# EAGLE schematic arduino_smartsensor_shield (EAGLE 7.4.0)
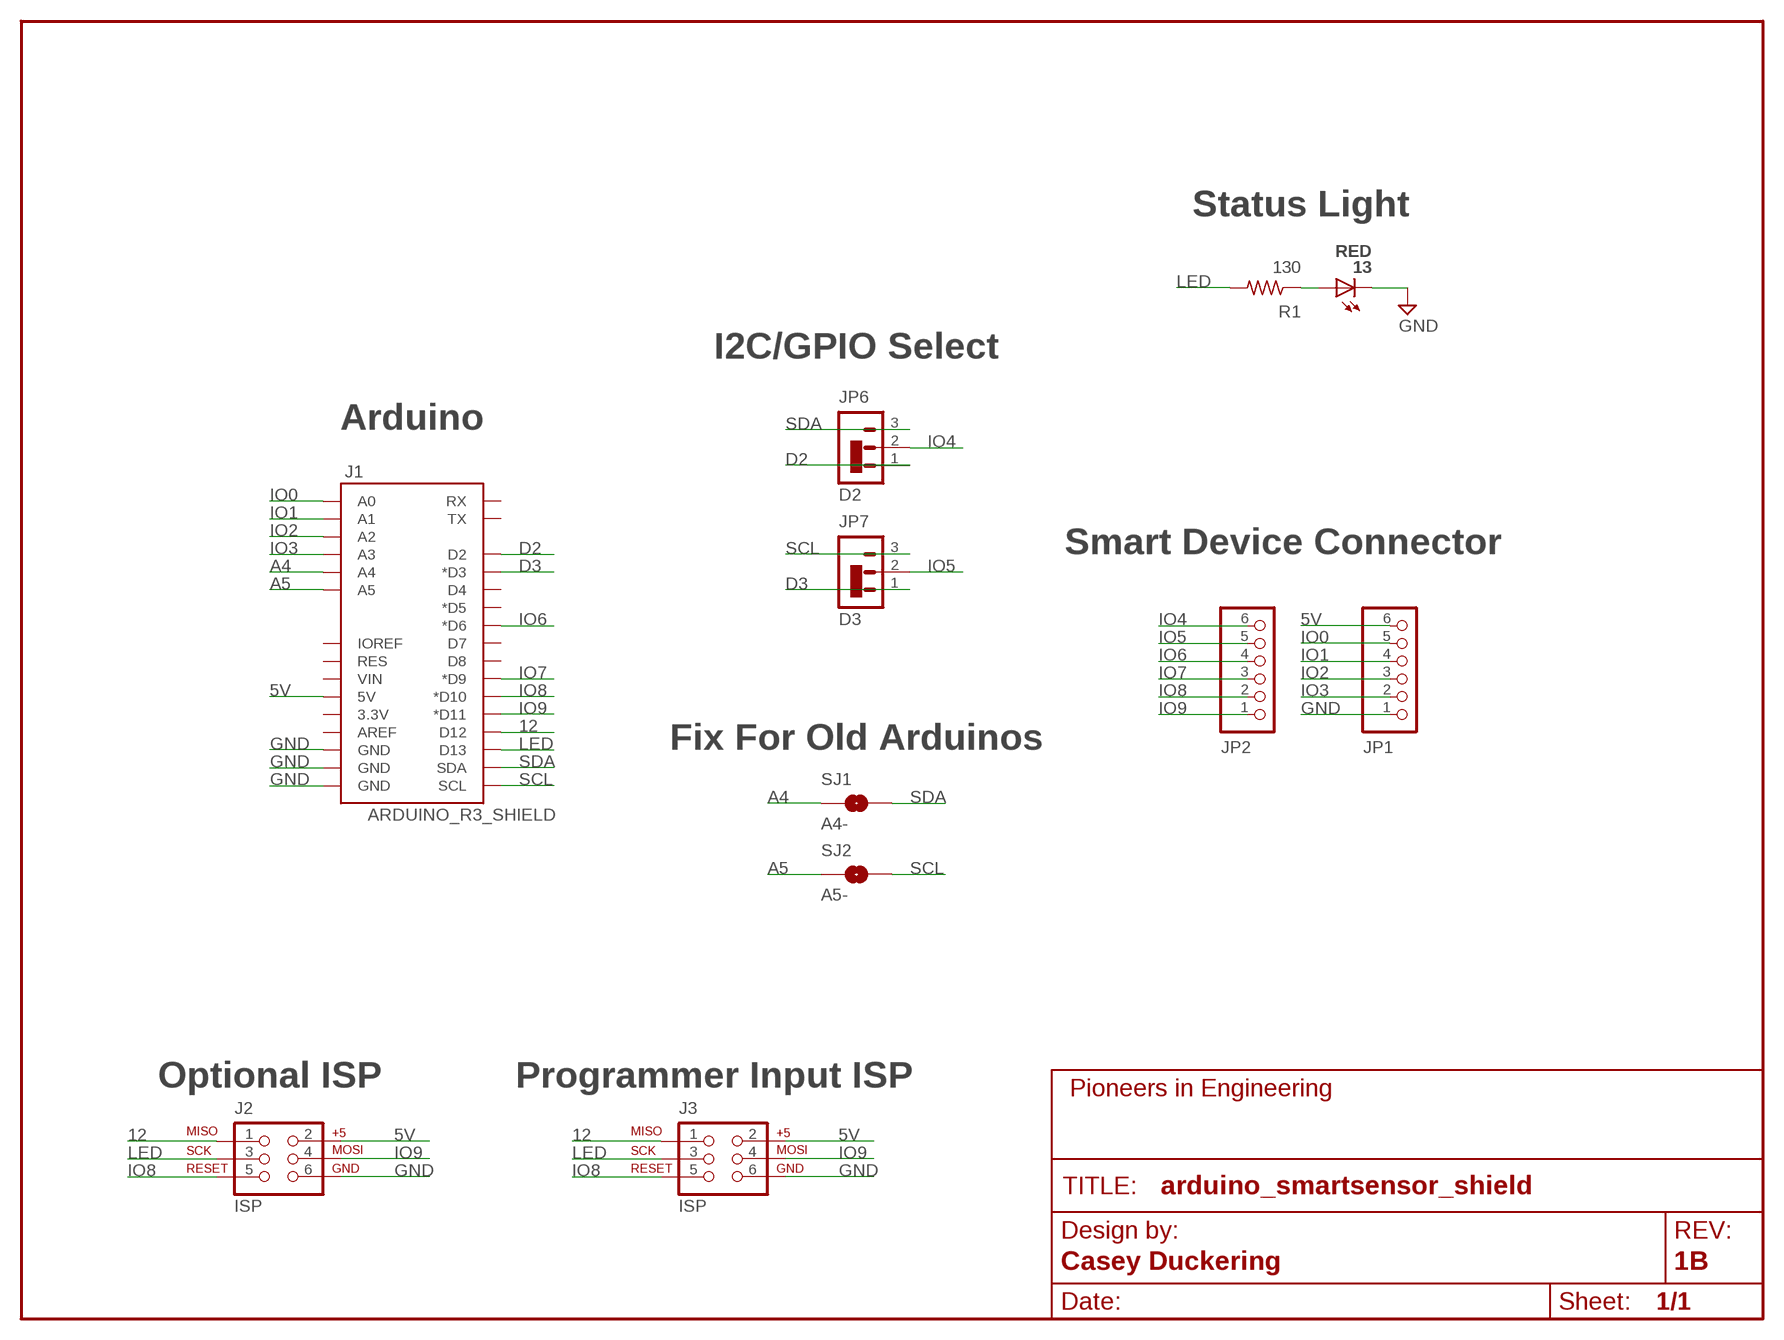
[diagram p0: schematic, sheet 1]
FRAME1 (FRAME-LETTER): AUTHOR: Casey Duckering; REVISION: 1B

## Parts
13  RED  LED0805  [LED-0805]
J1  ARDUINO_R3_SHIELD  [UNO_R3_SHIELD]
J2  ISP  AVR_SPI_PRG_6PTH  [2X3]
J3  ISP  AVR_SPI_PRG_6PTH  [2X3]
JP1  PINHD-1X6STRAIN-RELIEF  [1X06-STRAINRELIEF]
JP2  PINHD-1X6  [1X06]
JP6  D2  JMP-OPTION  [1X03-JMP-OPTION]
JP7  D3  JMP-OPTION  [1X03-JMP-OPTION]
R1  130  R-US_R0603  [R0603]
SJ1  A4-  SOLDERJUMPERNO  [SJ_2S-NO]
SJ2  A5-  SOLDERJUMPERNO  [SJ_2S-NO]

## Nets
5V: J1.5V J2.2 J3.2 JP1.6
12: J1.D12 J2.1 J3.1
A4: J1.A4 SJ1.1
A5: J1.A5 SJ2.1
D2: J1.D2 JP6.1
D3: J1.D3(*D3) JP7.1
GND: 13.C J1.GND@0(GND) J1.GND@1(GND) J1.GND@2(GND) J2.6 J3.6 JP1.1
IO0: J1.A0 JP1.5
IO1: J1.A1 JP1.4
IO2: J1.A2 JP1.3
IO3: J1.A3 JP1.2
IO4: JP2.6 JP6.2(COMMON)
IO5: JP2.5 JP7.2(COMMON)
IO6: J1.D6(*D6) JP2.4
IO7: J1.D9(*D9) JP2.3
IO8: J1.D10(*D10) J2.5 J3.5 JP2.2
IO9: J1.D11(*D11) J2.4 J3.4 JP2.1
LED: J1.D13 J2.3 J3.3 R1.2
N$1: 13.A R1.1
SCL: J1.SCL JP7.3 SJ2.2
SDA: J1.SDA JP6.3 SJ1.2
Unconnected: J1.3.3V J1.AREF J1.D4 J1.D5(*D5) J1.D7 J1.D8 J1.IOREF J1.RES J1.RX J1.TX J1.VIN

## Notes on the sheet
- Status Light
- I2C/GPIO Select
- Arduino
- Smart Device Connector
- Fix For Old Arduinos
- Optional ISP | Programmer Input ISP

## Library data of the parts
13 = pie:LED: LEDs Standard schematic elements and footprints for 5mm, 3mm, 1206, and 0603 sized LEDs. 5mm - Spark Fun Electronics SKU : COM-00529 (and others); PIE-INT-REF-NUM: LED
J1 = SparkFun-Boards:ARDUINO_R3_SHIELD: Shield form compatible with the Arduino Uno R3.
J2 J3 = pie:AVR_SPI_PRG_6: AVR ISP 6 Pin This is the reduced ISP connector for AVR programming. Common on Arduino. This footprint will take up less PCB space and can be used with a 10-pin to 6-pin adapter such as SKU: BOB-08508; PIE-INT-REF-NUM: BULK-STOCK
JP1 = pie:PINHD-1X6: 6-pin 0.1-inch header
JP2 = pie:PINHD-1X6: 6-pin 0.1-inch header; PARTNUMBER: 965
JP6 JP7 = pie:JMP-OPTION: A 3 pin header with silk screen indicating jumper positions to select an option.
R1 = pie:R-US_: RESISTOR, American symbol; PIE-INT-REF-NUM: RESISTOR-GENERIC
SJ1 SJ2 = pie:SOLDERJUMPER: Solder Jumper Standard SMD solder jumper. Used to automate production. Two varients : Normally Open and Normally Closed are the same, but have different paste layers. NC will have a large amount of paste and should jumper during reflow.; PIE-INT-REF-NUM: DNL